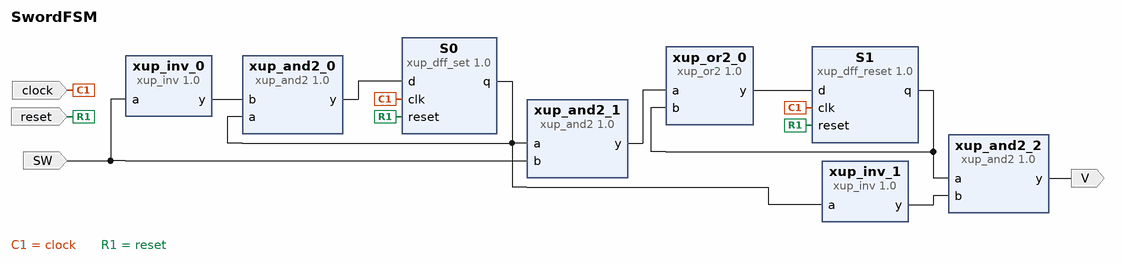
[diagram p0: block diagram of the top level]
# Vivado block design SwordFSM, xc7a100tcsg324-1, Vivado 2019.2
create_bd_design SwordFSM

create_bd_port -dir I SW
create_bd_port -dir O V
create_bd_port -dir I -type clk clock
create_bd_port -dir I -type rst reset
set_property -dict {CONFIG.POLARITY ACTIVE_HIGH} [get_bd_ports reset]

create_bd_cell -type ip -vlnv xilinx.com:user:xup_dff_set:1.0 S0
create_bd_cell -type ip -vlnv xilinx.com:user:xup_dff_reset:1.0 S1
create_bd_cell -type ip -vlnv xilinx.com:xup:xup_and2:1.0 xup_and2_0
create_bd_cell -type ip -vlnv xilinx.com:xup:xup_and2:1.0 xup_and2_1
create_bd_cell -type ip -vlnv xilinx.com:xup:xup_and2:1.0 xup_and2_2
create_bd_cell -type ip -vlnv xilinx.com:xup:xup_inv:1.0 xup_inv_0
create_bd_cell -type ip -vlnv xilinx.com:xup:xup_inv:1.0 xup_inv_1
create_bd_cell -type ip -vlnv xilinx.com:xup:xup_or2:1.0 xup_or2_0

# ---- connections ----

connect_bd_net [get_bd_pins S0/q] [get_bd_pins xup_and2_0/a] [get_bd_pins xup_and2_1/a] [get_bd_pins xup_inv_1/a]
connect_bd_net [get_bd_pins S1/q] [get_bd_pins xup_and2_2/a] [get_bd_pins xup_or2_0/b]
connect_bd_net [get_bd_ports SW] [get_bd_pins xup_and2_1/b] [get_bd_pins xup_inv_0/a]
connect_bd_net -net clk_0_1 [get_bd_ports clock] [get_bd_pins S0/clk] [get_bd_pins S1/clk]
connect_bd_net -net reset_0_1 [get_bd_ports reset] [get_bd_pins S0/reset] [get_bd_pins S1/reset]
connect_bd_net [get_bd_pins xup_and2_0/y] [get_bd_pins S0/d]
connect_bd_net [get_bd_pins xup_and2_1/y] [get_bd_pins xup_or2_0/a]
connect_bd_net [get_bd_pins xup_and2_2/y] [get_bd_ports V]
connect_bd_net [get_bd_pins xup_inv_0/y] [get_bd_pins xup_and2_0/b]
connect_bd_net [get_bd_pins xup_inv_1/y] [get_bd_pins xup_and2_2/b]
connect_bd_net [get_bd_pins xup_or2_0/y] [get_bd_pins S1/d]

validate_bd_design
save_bd_design
